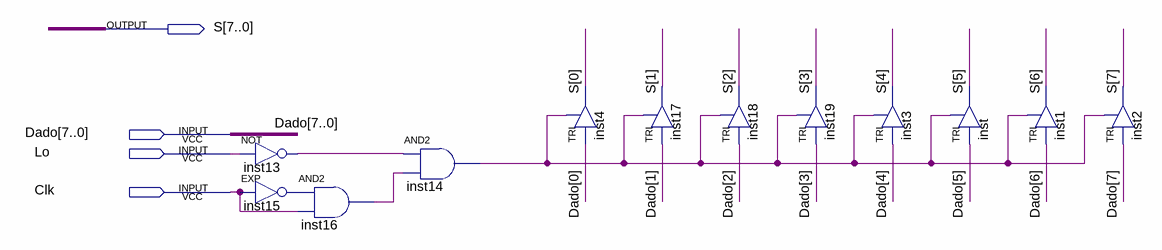
[diagram p0: schematic sheet]
// Quartus schematic Registrador_de_saida.bdf as structural Verilog: 12 symbols, 4 pins
module Registrador_de_saida (
  input  [7:0] Dado,
  input  Lo,
  input  Clk,
  output [7:0] S
);

  wire inst13_out, inst14_out, inst15_out, inst16_out;

  not inst13 (inst13_out, Lo);
  EXP inst15 (.IN(Clk), .OUT(inst15_out));
  and inst16 (inst16_out, inst15_out, Clk);
  and inst14 (inst14_out, inst13_out, inst16_out);
  TRI inst4 (.IN(Dado[0]), .OE(inst14_out), .OUT(S[0]));
  TRI inst17 (.IN(Dado[1]), .OE(inst14_out), .OUT(S[1]));
  TRI inst18 (.IN(Dado[2]), .OE(inst14_out), .OUT(S[2]));
  TRI inst19 (.IN(Dado[3]), .OE(inst14_out), .OUT(S[3]));
  TRI inst3 (.IN(Dado[4]), .OE(inst14_out), .OUT(S[4]));
  TRI inst (.IN(Dado[5]), .OE(inst14_out), .OUT(S[5]));
  TRI inst1 (.IN(Dado[6]), .OE(inst14_out), .OUT(S[6]));
  TRI inst2 (.IN(Dado[7]), .OE(inst14_out), .OUT(S[7]));
endmodule
